# Altium schematic sheet 1_Sheet_1.schdoc
size 307 x 218 mm; Symbol: Sheet-Symbol_A4; Device: Sheet-Symbol_A4; Company: 嘉立创EDA; Drawed: Fukui (Daniel) Yang; Version: V1.0; Page Size: A4; @Project Name: OptoGrid_V0.05; @Page Count: 1; @Update Date: 2025-09-04; @Create Date: 2025-08-04; @Schematic Name: OptoGrid_Programmer_V0.05; @Page No: 1; @Page Name: Sheet_1; Title Block Position: 3; Width: 1170; Height: 825; Region Start: 1; X Region Count: 6; Y Region Count: 4; Blade Width: 10; @Board Name: OptoGrid_Programmer_V0.05; @Create Time: 15:05:22; @Update Time: 09:46:29
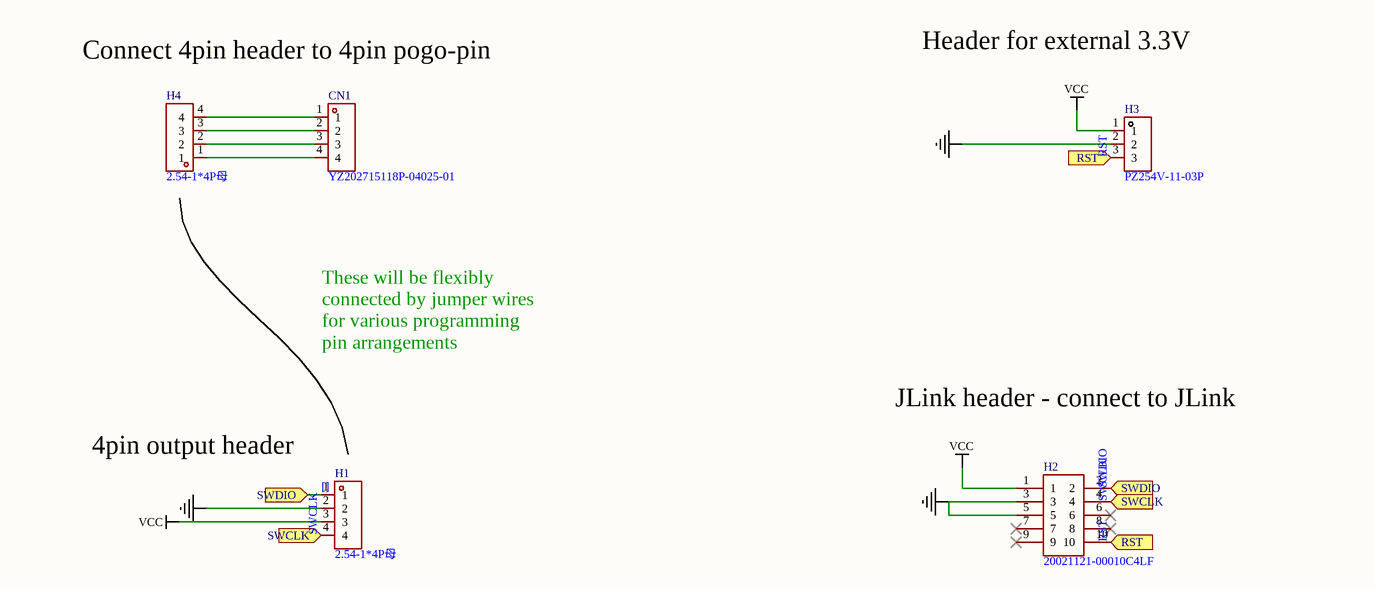
[diagram p0: 1_Sheet_1.schdoc]

## Parts
CN1  YZ202715118P-04025-01  [BAT-TH_4P-P2.50_YZ202715118P-04025-01]
H1  2.54-1*4P母  [HDR-TH_4P-P2.54-V-F]
H2  20021121-00010C4LF  [HDR-SMD_10P-P1.27-V-M-R2-C5-S1.27-LS5.5]
H3  PZ254V-11-03P  [HDR-TH_3P-P2.54-V-M]
H4  2.54-1*4P母  [HDR-TH_4P-P2.54-V-F]

## Ports
RST (in), SWCLK (in), SWDIO (in)

## Nets
GND: H1.2 H2.3 H2.5 H3.2
VCC: H1.3 H2.1 H3.1
[]: H1.1 H2.2 ; port SWDIO  [also labelled SWDIO]
RST: H2.10 H3.3 ; port RST
SWCLK: H1.4 H2.4 ; port SWCLK
NetCN1_1: CN1.1 H4.4
NetCN1_2: CN1.2 H4.3
NetCN1_3: CN1.3 H4.2
NetCN1_4: CN1.4 H4.1

Not connected (* = marked no-connect by the designer): H2 6* 7* 8* 9*

## Notes on the sheet
- Connect 4pin header to 4pin pogo-pin
- Header for external 3.3V
- These will be flexibly
  connected by jumper wires
  for various programming
  pin arrangements
- (near H1) 4pin output header
- JLink header - connect to JLink
- 1
- 2
- 3
- 4
- 5
- 6
- A
- B
- C
- 原理图
- OptoGrid_Programmer_V0.05
- 创建日期
- 更新日期
- 2025-09-04
- 2025-08-04
- 绘制
- 图页
- Fukui (Daniel) Yang
- Sheet_1
- 物料编码
- D
- 审阅
- 版本
- 尺寸
- OptoGrid_V0.05
- 页
- 共
- V1.0
- A4
- 嘉立创EDA

## Library data of the parts
CN1 = YZ202715118P-04025-01: Manufacturer: Xinyangze(鑫扬泽); Add into BOM: yes; Pitch: 2.5mm; Overall Length/Height: 11.8mm; Operational Height: 8.8mm; Contact Resistance: 50mΩ; Elastic Life: 10000次; Rated Current: 2A; Rated Voltage: 12V; Symbol: YZ202715118P-04025-01; Device: YZ202715118P-04025-01; LCSC Part Name: 4pin插件弹簧顶针连接器; Supplier Part: C5200688; Manufacturer Part: YZ202715118P-04025-01; Supplier Footprint: -; JLCPCB Part Class: 扩展库; Datasheet: https://atta.szlcsc.com/upload/public/pdf/source/20221019/0919E530BBF6DFF73CECBA7E447C2B8F.pdf; Supplier: LCSC; Convert to PCB: yes; Type: 弹簧顶针(POGO PIN); Number of Pins: 四PIN位; Contact Material: 黄铜; Contact Plating: 金; Operating Temperature Range: -20℃~+70℃
H1 H4 = 2.54-1*4P母: Manufacturer: BOOMELE(博穆精密); Add into BOM: yes; Holes Structure: 1x4P; Pitch: 2.54mm; Circular Hole / Square Hole: 方孔; Number of Holes: 4P; Current Rating (Max): 3A; Holes Direction: 顶部; Symbol: 2.54-1*4P母; Device: 2.54-1*4P母; LCSC Part Name: 间距:2.54mm 1x4P 直插; Supplier Part: C2718488; Manufacturer Part: 2.54-1*4P母; Supplier Footprint: 插件,P=2.54mm; JLCPCB Part Class: Extended Part; Datasheet: https://atta.szlcsc.com/upload/public/pdf/source/20210301/C2718488_F4427B881E42CAA8DDB0B1C12B3A522C.pdf; Supplier: LCSC; Convert to PCB: yes; Row Spacing: -; Mounting Type: 直插; Number of Rows: 单排; Voltage Rating (Max): -; Insulation Height: -; Contact Material: 青铜; Contact Plating: -; Operating Temperature Range: -40℃~+105℃; Soldering Temperature(Max): -
H2 = 20021121-00010C4LF: Manufacturer: Amphenol; Add into BOM: yes; Pin Structure: 2x5P; Pitch: 1.27mm; Symbol: 20021121-00010C4LF; Device: 20021121-00010C4LF; LCSC Part Name: 间距:1.27mm 2x5P 立贴; Supplier Part: C150517; Manufacturer Part: 20021121-00010C4LF; Supplier Footprint: SMD,P=1.27mm; JLCPCB Part Class: 扩展库; Datasheet: https://atta.szlcsc.com/upload/public/pdf/source/20180619/C239061_0A91EF97BE287FE12DFBF9350A11B160.pdf; Supplier: LCSC; Convert to PCB: yes; Row Spacing: 1.27mm; Circluar Pins/Square Pins: -; Mounting Type: 立贴; Number of Rows: 双排; Number of Pins: 10P; Current Rating (Max): -; Voltage Rating (Max): -; Length of Mating Pin: -; Insulation Height: -; Contact Material: 铜合金; Contact Plating: -; Color: 黑色
H3 = PZ254V-11-03P: Manufacturer: XFCN(兴飞); Symbol: PZ254V-11-03P_C2937625; Add into BOM: yes; Pin Structure: 1x3P; Pitch: 2.54mm; Circluar Pins/Square Pins: 方针; Current Rating: 3A; Voltage Rating (Max): 250V; Device: PZ254V-11-03P; LCSC Part Name: 1x3P 间距:2.54mm 方针 直插; Supplier Part: C2937625; Manufacturer Part: PZ254V-11-03P; Supplier Footprint: 插件,P=2.54mm; JLCPCB Part Class: 扩展库; Datasheet: https://atta.szlcsc.com/upload/public/pdf/source/20200309/C492402_8335C3D49C4E4C618838D59BB1D024C1.pdf; Supplier: LCSC; Convert to PCB: yes; Row Spacing: -; Mounting Type: 直插; Number of Rows: 单排; Number of Pins: 3P; Length of Mating Pin: 6mm; Insulation Height: 2.5mm; Length of End Connection Pin: 3mm; Operating Temperature: -40℃~+105℃; Color: 黑色